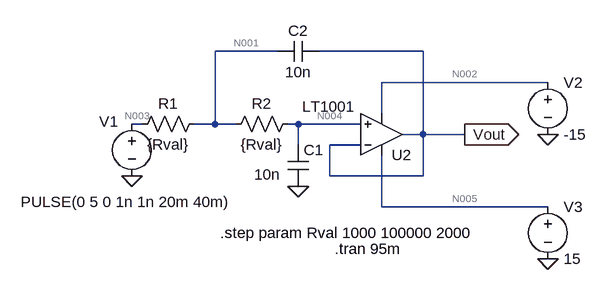
[diagram p0: schematic Sallen_key_normal_sweep.asc]
Sallen_key_normal_sweep.asc, the LTspice schematic file:
Version 4.1
SHEET 1 880 680
WIRE 96 48 0 48
WIRE 320 48 160 48
WIRE 512 96 256 96
WIRE 256 144 256 96
WIRE -112 160 -128 160
WIRE 0 160 0 48
WIRE 0 160 -32 160
WIRE 32 160 0 160
WIRE 128 160 112 160
WIRE 224 160 128 160
WIRE 320 176 320 48
WIRE 320 176 288 176
WIRE 384 176 320 176
WIRE 128 192 128 160
WIRE 224 192 176 192
WIRE 176 240 176 192
WIRE 320 240 320 176
WIRE 320 240 176 240
WIRE 256 288 256 208
WIRE 512 288 256 288
FLAG 128 256 0
FLAG -128 240 0
FLAG 384 176 Vout
IOPIN 384 176 Out
FLAG 512 176 0
FLAG 512 368 0
SYMBOL cap 112 192 R0
WINDOW 3 -52 46 Left 2
SYMATTR Value 10n
SYMATTR InstName C1
SYMBOL res -16 144 R90
WINDOW 0 0 56 VBottom 2
WINDOW 3 32 56 VTop 2
SYMATTR InstName R1
SYMATTR Value {Rval}
SYMBOL res 128 144 R90
WINDOW 0 0 56 VBottom 2
WINDOW 3 32 56 VTop 2
SYMATTR InstName R2
SYMATTR Value {Rval}
SYMBOL voltage -128 144 R0
WINDOW 0 -50 12 Left 2
WINDOW 3 -171 136 Left 2
WINDOW 123 0 0 Left 0
WINDOW 39 0 0 Left 0
SYMATTR InstName V1
SYMATTR Value PULSE(0 5 0 1n 1n 20m 40m)
SYMBOL cap 160 32 R90
WINDOW 0 0 32 VBottom 2
WINDOW 3 32 32 VTop 2
SYMATTR InstName C2
SYMATTR Value 10n
SYMBOL OpAmps\\LT1001 256 240 M180
WINDOW 3 -122 107 Left 2
SYMATTR InstName U2
SYMBOL voltage 512 80 R0
WINDOW 123 0 0 Left 0
WINDOW 39 0 0 Left 0
SYMATTR InstName V2
SYMATTR Value -15
SYMBOL voltage 512 272 R0
WINDOW 123 0 0 Left 0
WINDOW 39 0 0 Left 0
SYMATTR InstName V3
SYMATTR Value 15
TEXT 184 352 Left 2 !.tran 95m
TEXT 8 328 Left 2 !.step param Rval 1000 100000 2000

The netlist it stands for:
* Sallen_key_normal_sweep.asc
C1 N004 0 10n
R1 N001 N003 {Rval}
R2 N004 N001 {Rval}
V1 N003 0 PULSE(0 5 0 1n 1n 20m 40m)
C2 Vout N001 10n
X§U2 N004 Vout N005 N002 Vout LT1001  ; pins In+ In- V+ V- OUT
V2 N002 0 -15
V3 N005 0 15
.tran 95m
.step param Rval 1000 100000 2000
.lib LTC.lib
.backanno
.end

* Results of the author's LTspice run, read from the files saved beside the schematic
* Operating Point (first step), zero values left out:
*   V(n002) = -15 V
*   V(n005) = 15 V
*   I(V2) = 2.25 mA
*   I(V3) = -2.25 mA
*   Ix(u2:3) = 2.25 mA
*   Ix(u2:4) = -2.25 mA
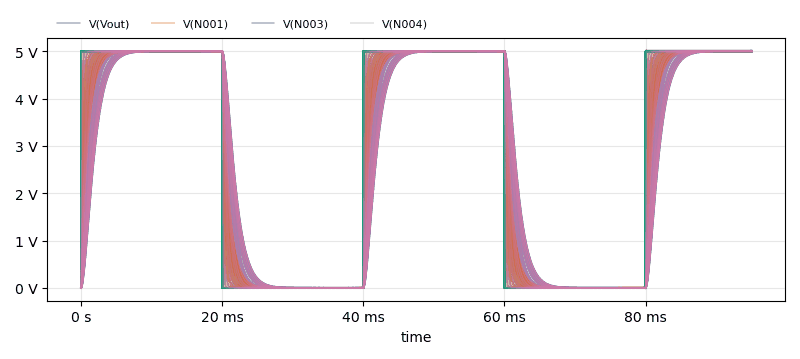
[diagram p1: Transient Analysis of Sallen_key_normal_sweep.asc, plotted from the saved traces]
* Transient Analysis, 51 runs:
*   V(Vout) [run 1]: min -20.01 mV, max 5.019 V, average 2.894 V, rms 3.802 V, last 5.019 V
*   V(Vout) [run 2]: min -4.821 mV, max 5.004 V, average 2.887 V, rms 3.791 V, last 5 V
*   V(Vout) [run 3]: min -2.394 mV, max 5.002 V, average 2.881 V, rms 3.779 V, last 5 V
*   V(Vout) [run 4]: min -1.484 mV, max 5.002 V, average 2.873 V, rms 3.763 V, last 5 V
*   V(Vout) [run 5]: min -1.23 mV, max 5.001 V, average 2.866 V, rms 3.751 V, last 5 V
*   V(Vout) [run 6]: min -1.018 mV, max 5.001 V, average 2.86 V, rms 3.738 V, last 5 V
*   V(Vout) [run 7]: min -915.7 µV, max 5.001 V, average 2.852 V, rms 3.722 V, last 5 V
*   V(Vout) [run 8]: min -957.1 µV, max 5.001 V, average 2.845 V, rms 3.71 V, last 5 V
*   V(N001) [run 1]: min -8.733 mV, max 5.019 V, average 2.894 V, rms 3.803 V, last 5.019 V
*   V(N001) [run 2]: min -83.79 µV, max 5.001 V, average 2.891 V, rms 3.796 V, last 5 V
*   V(N001) [run 3]: min -46.61 µV, max 5 V, average 2.888 V, rms 3.789 V, last 5 V
*   V(N001) [run 4]: min -190.9 µV, max 5 V, average 2.884 V, rms 3.779 V, last 5 V
*   V(N001) [run 5]: min -66.01 µV, max 5 V, average 2.881 V, rms 3.772 V, last 5 V
*   V(N001) [run 6]: min -226.7 µV, max 5 V, average 2.877 V, rms 3.765 V, last 5 V
*   V(N001) [run 7]: min -505.8 µV, max 5 V, average 2.873 V, rms 3.755 V, last 5 V
*   V(N001) [run 8]: min -87.4 µV, max 5 V, average 2.87 V, rms 3.747 V, last 5 V
*   V(N003) [run 1]: min 0 V, max 5 V, average 2.895 V, rms 3.804 V, last 5 V
*   V(N003) [run 2]: min 0 V, max 5 V, average 2.895 V, rms 3.804 V, last 5 V
*   V(N003) [run 3]: min 0 V, max 5 V, average 2.895 V, rms 3.804 V, last 5 V
*   V(N003) [run 4]: min 0 V, max 5 V, average 2.895 V, rms 3.804 V, last 5 V
*   V(N003) [run 5]: min 0 V, max 5 V, average 2.895 V, rms 3.804 V, last 5 V
*   V(N003) [run 6]: min 0 V, max 5 V, average 2.895 V, rms 3.804 V, last 5 V
*   V(N003) [run 7]: min 0 V, max 5 V, average 2.895 V, rms 3.804 V, last 5 V
*   V(N003) [run 8]: min 0 V, max 5 V, average 2.895 V, rms 3.804 V, last 5 V
*   V(N004) [run 1]: min -4.64 µV, max 5 V, average 2.894 V, rms 3.802 V, last 5 V
*   V(N004) [run 2]: min 0 V, max 5 V, average 2.887 V, rms 3.791 V, last 5 V
*   V(N004) [run 3]: min 0 V, max 5 V, average 2.881 V, rms 3.779 V, last 5 V
*   V(N004) [run 4]: min 0 V, max 5 V, average 2.873 V, rms 3.763 V, last 5 V
*   V(N004) [run 5]: min 0 V, max 5 V, average 2.866 V, rms 3.751 V, last 5 V
*   V(N004) [run 6]: min 0 V, max 5 V, average 2.86 V, rms 3.738 V, last 5 V
*   V(N004) [run 7]: min 0 V, max 5 V, average 2.852 V, rms 3.722 V, last 5 V
*   V(N004) [run 8]: min 0 V, max 5 V, average 2.845 V, rms 3.71 V, last 5 V